# Altium project LCD_Controller_Baord.PrjPcb
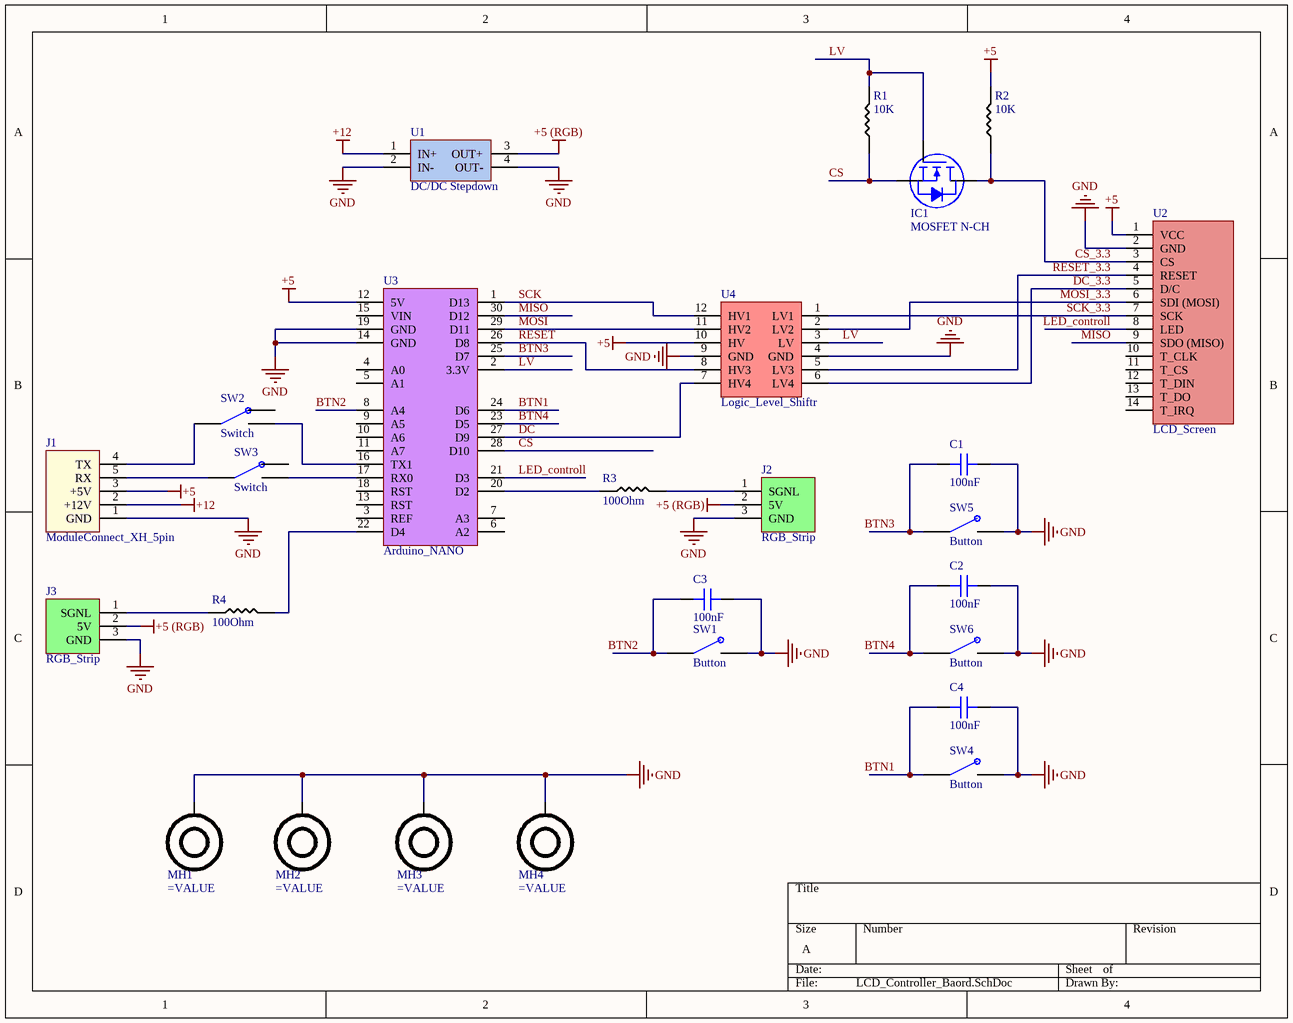
[diagram p0: LCD_Controller_Baord.SchDoc]
1 sheet, 26 parts. Net scope: global (net labels, ports and power ports of the same name join across sheets).
Board file: LCD_Controller_Baord.PcbDoc

## Sheet LCD_Controller_Baord.SchDoc
size A; SheetNumber: 1; SheetTotal: 1

### Parts
C1  100nF  [CAP 0603]
C2  100nF  [CAP 0603]
C3  100nF  [CAP 0603]
C4  100nF  [CAP 0603]
IC1  MOSFET N-CH  [SOT-23]
J1  ModuleConnect_XH_5pin  [JST S5B-XH-A]
J2  RGB_Strip  [JST_S3B-XH-A(LF)(SN)]
J3  RGB_Strip  [JST_S3B-XH-A(LF)(SN)]
MH1  (no value)  [SCREW_M3.0]
MH2  (no value)  [SCREW_M3.0]
MH3  (no value)  [SCREW_M3.0]
MH4  (no value)  [SCREW_M3.0]
R1  value 10K  [RES 0603]  (hidden comment: 100Ohm)
R2  value 10K  [RES 0603]  (hidden comment: 100Ohm)
R3  100Ohm  [RES 0603]
R4  100Ohm  [RES 0603]
SW1  Button  [SW_FSM8JH]
SW2  Switch  [EG1218]
SW3  Switch  [EG1218]
SW4  Button  [SW_FSM8JH]
SW5  Button  [SW_FSM8JH]
SW6  Button  [SW_FSM8JH]
U1  DC/DC Stepdown  [DC/DC Stepdown]
U2  LCD_Screen  [14_PIN_LCD]
U3  Arduino_NANO  [MODULE_ABX00028]
U4  Logic_Level_Shiftr  [Logic_Shifter]

### Nets
+5: J1.3(+5V) R2.2 U2.1(VCC) U3.12(5V) U4.10(HV)
+5 (RGB): J2.2(5V) J3.2(5V) U1.3(OUT+)
+12: J1.2(+12V) U1.1(IN+)
GND: C1.2 C2.2 C3.2 C4.2 J1.1(GND) J2.3(GND) J3.3(GND) MH1.1 MH2.1 MH3.1 MH4.1 SW1.2 SW4.2 SW5.2 SW6.2 U1.2(IN-) U1.4(OUT-) U2.2(GND) U3.14(GND) U3.19(GND) U4.4(GND) U4.9(GND)
BTN1: C4.1 SW4.1 U3.24(D6)
BTN2: C3.1 SW1.1 U3.8(A4)
BTN3: C1.1 SW5.1 U3.25(D7)
BTN4: C2.1 SW6.1 U3.23(D5)
CS: IC1.2(S) R1.1 U3.28(D10)
CS_3.3: IC1.3(D) R2.1 U2.3(CS)
DC: U3.27(D9) U4.7(HV4)
DC_3.3: U2.5(D/C) U4.6(LV4)
LED_controll: U2.8(LED) U3.21(D3)
LV: IC1.1(G) R1.2 U3.2(3.3V) U4.3(LV)
MISO: U2.9(SDO_(MISO)) U3.30(D12)
MOSI: U3.29(D11) U4.11(HV2)
MOSI_3.3: U2.6(SDI_(MOSI)) U4.2(LV2)
RESET: U3.26(D8) U4.8(HV3)
RESET_3.3: U2.4(RESET) U4.5(LV3)
SCK: U3.1(D13) U4.12(HV1)
SCK_3.3: U2.7(SCK) U4.1(LV1)
NetJ1_4: J1.4(TX) SW2.2
NetJ1_5: J1.5(RX) SW3.2
NetJ2_1: J2.1(SGNL) R3.2
NetJ3_1: J3.1(SGNL) R4.2
NetR3_1: R3.1 U3.20(D2)
NetR4_1: R4.1 U3.22(D4)
NetSW2_3: SW2.3 U3.16(TX1)
NetSW3_3: SW3.3 U3.17(RX0)

Not connected (* = marked no-connect by the designer): SW2 1; SW3 1; U2 10(T_CLK) 11(T_CS) 12(T_DIN) 13(T_DO) 14(T_IRQ); U3 3(REF) 4(A0) 5(A1) 6(A2) 7(A3) 9(A5) 10(A6) 11(A7) 13(RST) 15(VIN) 18(RST)

### Library data of the parts
C1-C4 = Capacitor: SMT Capacitor; Value: 100nF
MH1-MH4 = SCREW
R1-R4 = R_100Ohm_1206: 100Ω ±1% 0.25W ±100ppm/℃ 1206 Chip Resistor - Surface Mount RoHS; MFR Part #: 1206W4F1000T5E; LCSC Part#: C17901; Datasheet: https://datasheet.lcsc.com/lcsc/2206010145_UNI-ROYAL-Uniroyal-Elec-1206W4F1000T5E_C17901.pdf; Type: Basic
  R3 R4: Value: 100Ohm